# EAGLE design XBEE_BREAKOUT (EAGLE 9.3.0)
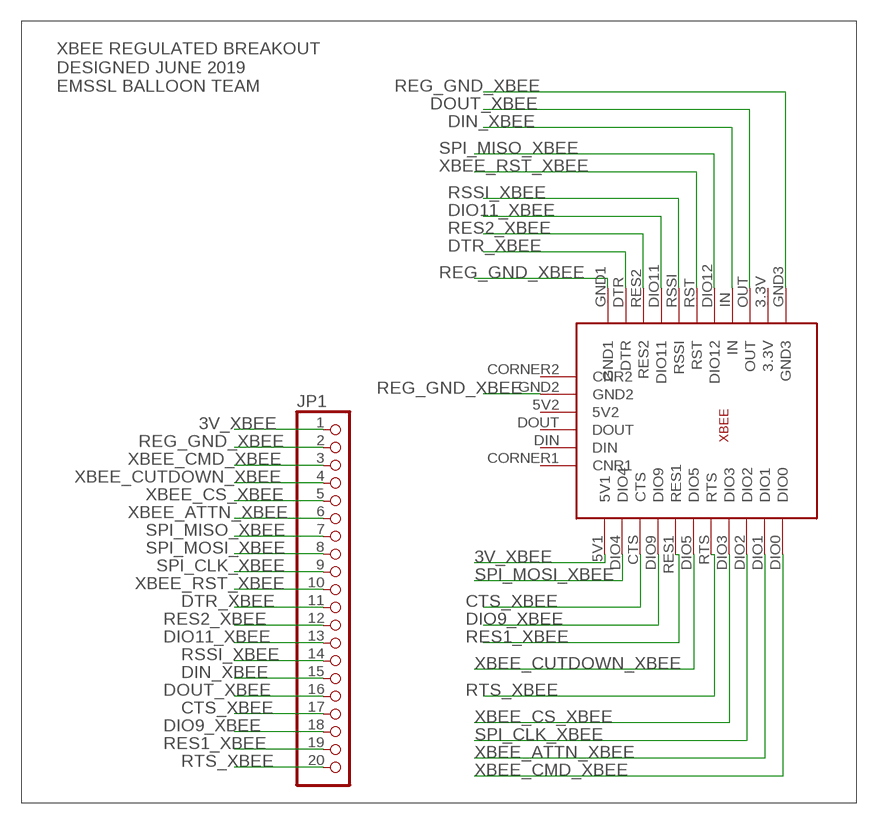
[diagram p0: schematic, sheet 1]

## Parts
JP1  PINHD-1X20/90  [1X20/90]
U$7  XBEE_XPLORER_REG  [XBEE_EXPLORER_REG'D]

## Nets
3V_XBEE: JP1.1 U$7.5V1
CTS_XBEE: JP1.17 U$7.CTS
DIN_XBEE: JP1.15 U$7.IN
DIO9_XBEE: JP1.18 U$7.DIO9
DIO11_XBEE: JP1.13 U$7.DIO11
DOUT_XBEE: JP1.16 U$7.OUT
DTR_XBEE: JP1.11 U$7.DTR
REG_GND_XBEE: JP1.2 U$7.GND1 U$7.GND2 U$7.GND3
RES1_XBEE: JP1.19 U$7.RES1
RES2_XBEE: JP1.12 U$7.RES2
RSSI_XBEE: JP1.14 U$7.RSSI
RTS_XBEE: JP1.20 U$7.RTS
SPI_CLK_XBEE: JP1.9 U$7.DIO2
SPI_MISO_XBEE: JP1.7 U$7.DIO12
SPI_MOSI_XBEE: JP1.8 U$7.DIO4
XBEE_ATTN_XBEE: JP1.6 U$7.DIO1
XBEE_CMD_XBEE: JP1.3 U$7.DIO0
XBEE_CS_XBEE: JP1.5 U$7.DIO3
XBEE_CUTDOWN_XBEE: JP1.4 U$7.DIO5
XBEE_RST_XBEE: JP1.10 U$7.RST
Unconnected: U$7.3.3V U$7.5V2 U$7.CORNER1(CNR1) U$7.CORNER2(CNR2) U$7.DIN U$7.DOUT

## Notes on the sheet
- XBEE REGULATED BREAKOUT 
  DESIGNED JUNE 2019 
  EMSSL BALLOON TEAM

## Library data of the parts
JP1 = pinhead:PINHD-1X20: PIN HEADER
U$7 = Adafruit_Arduino:XBEE_XPLORER_REG

## Board
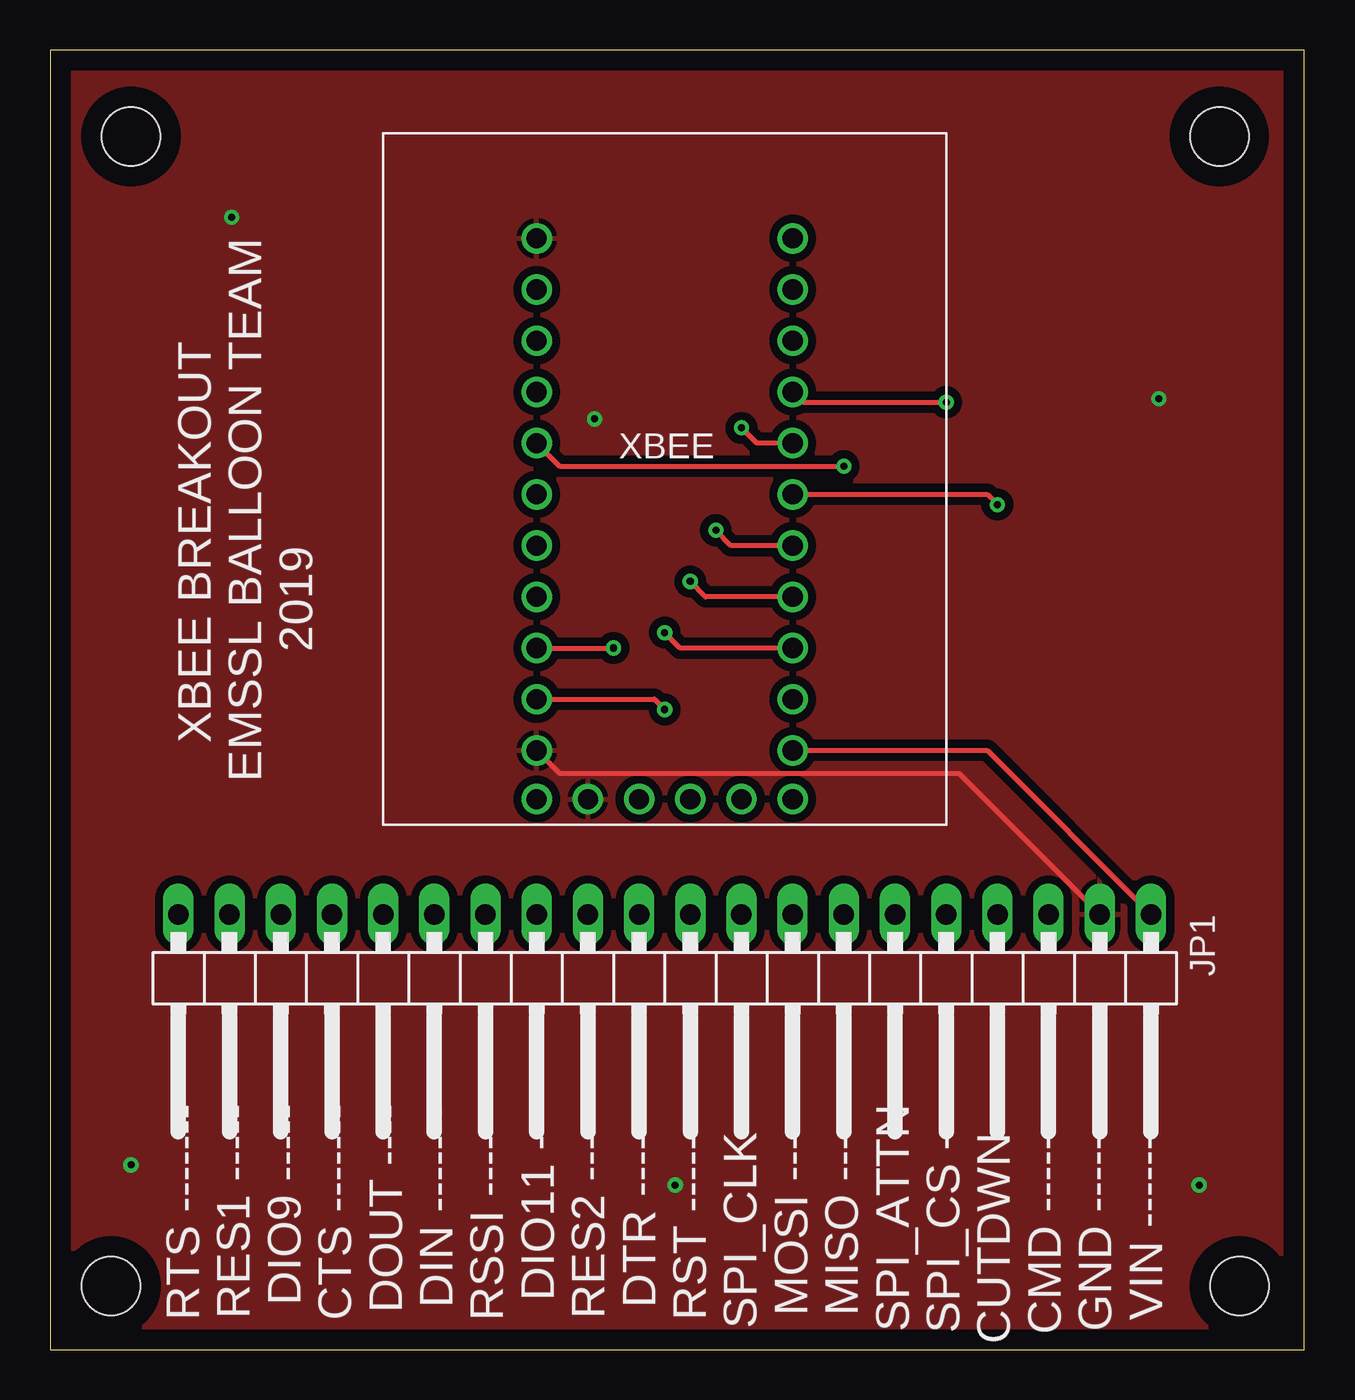
[diagram p1: board, top side]
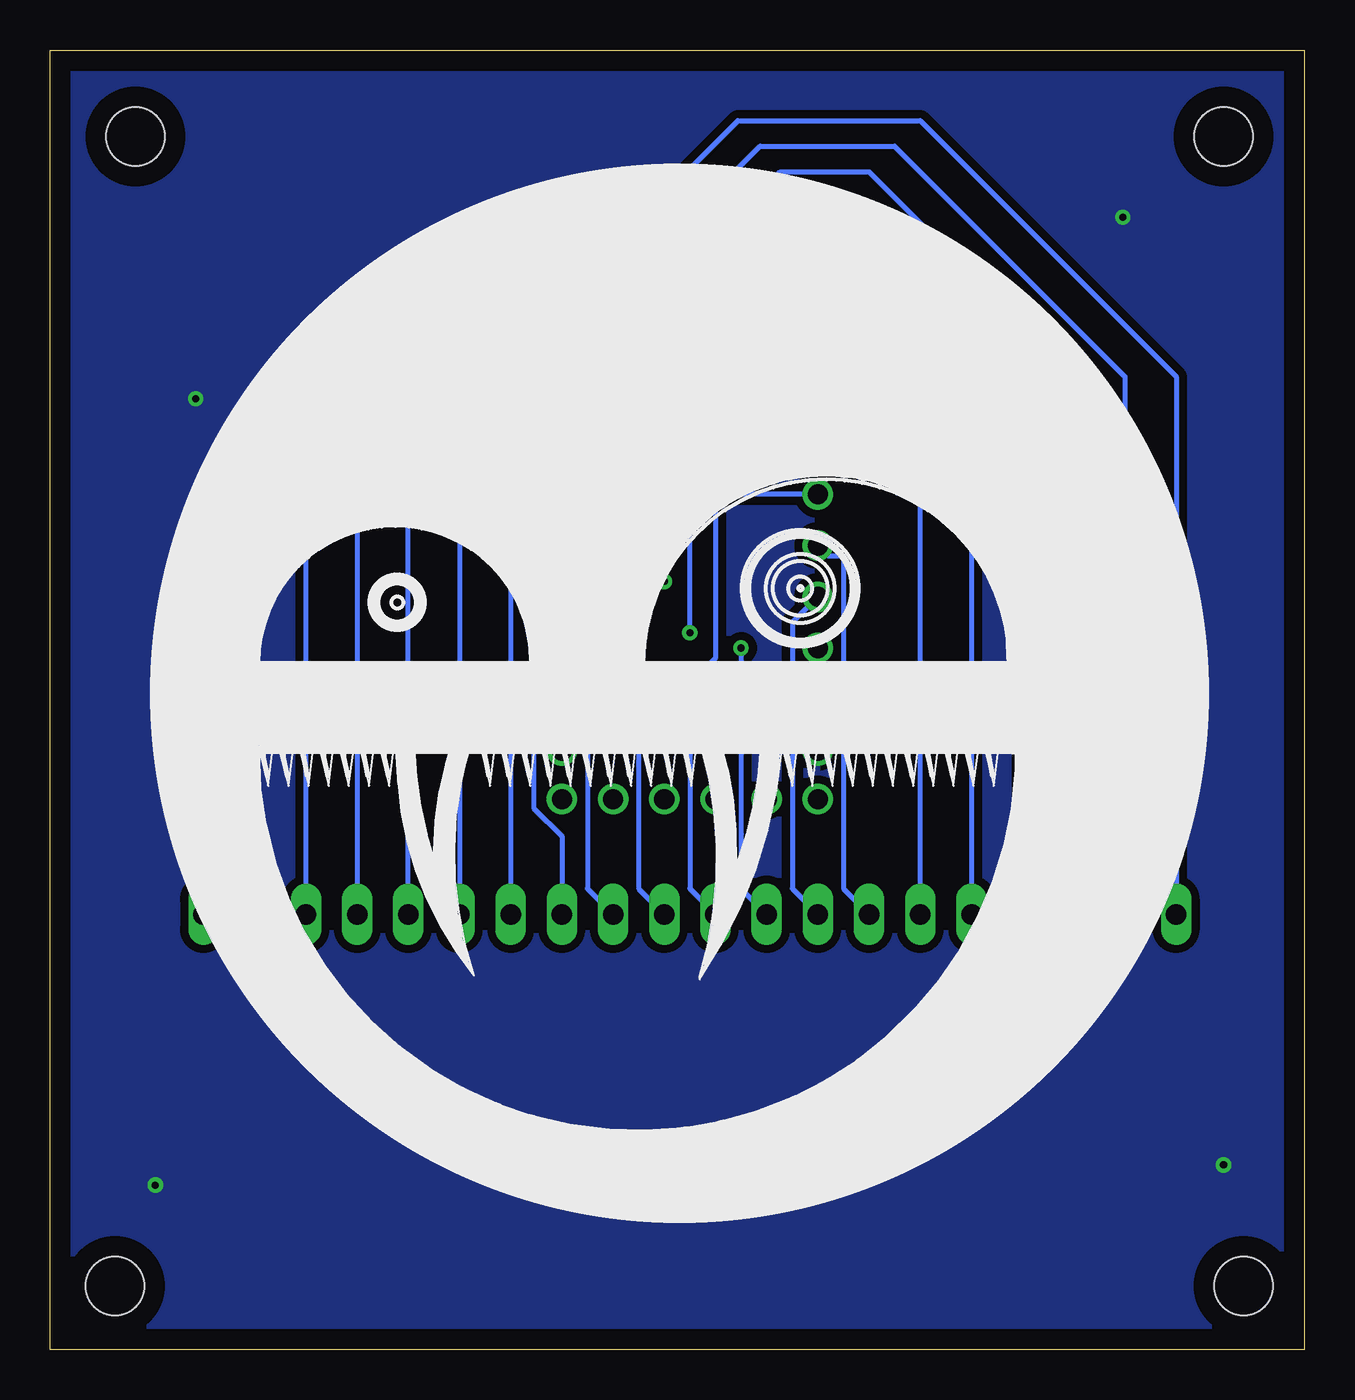
[diagram p2: board, bottom side, seen from below]

Size 62.21 x 64.44 mm. Coordinates in mm from the lower left corner, seen from the top.
Outline: 0,0 62.21,0 62.21,64.44 0,64.44 0,0
Copper layers (1*16): Top 0.035mm / dielectric 1.5mm / Bottom 0.035mm
Design rules "default": minimum track width 6mil, minimum drill 0.35mm, track to track 6mil, track to pad 6mil, pad to pad 6mil, via to via 6mil, smd to smd 6mil, copper to edge 40mil, drill to drill 6mil, minimum pad ring 10mil, minimum via ring 8mil, stop-mask expansion 4mil, vias tented up to drill 0mil, thermal gap 10mil
Holes 2.9 mm at 4,60.16 58,60.16 3,3.16 59,3.16

### Footprints (pad centres in the part's own frame; a part is rotated, then mirrored left to right if it is on the bottom)
1X20/90 = drill 1.016 long: 1 -24.13,-3.81; 2 -21.59,-3.81; 3 -19.05,-3.81; 4 -16.51,-3.81; 5 -13.97,-3.81; 6 -11.43,-3.81; 7 -8.89,-3.81; 8 -6.35,-3.81; 9 -3.81,-3.81; 10 -1.27,-3.81; 11 1.27,-3.81; 12 3.81,-3.81; 13 6.35,-3.81; 14 8.89,-3.81; 15 11.43,-3.81; 16 13.97,-3.81; 17 16.51,-3.81; 18 19.05,-3.81; 19 21.59,-3.81; 20 24.13,-3.81
XBEE_EXPLORER_REG'D = drill 1: 3.3V -6.35,9.398; 5V1 6.35,-13.462; 5V2 -1.27,-15.875; CORNER1 6.35,-15.875; CORNER2 -6.35,-15.875; CTS 6.35,-8.382; DIN 3.81,-15.875; DIO0 6.35,11.938; DIO1 6.35,9.398; DIO2 6.35,6.858; DIO3 6.35,4.318; DIO4 6.35,-10.922; DIO5 6.35,-0.762; DIO9 6.35,-5.842; DIO11 -6.35,-5.842; DIO12 -6.35,1.778; DOUT 1.27,-15.875; DTR -6.35,-10.922; GND1 -6.35,-13.462; GND2 -3.81,-15.875; GND3 -6.35,11.938; IN -6.35,4.318; OUT -6.35,6.858; RES1 6.35,-3.302; RES2 -6.35,-8.382; RSSI -6.35,-3.302; RST -6.35,-0.762; RTS 6.35,1.778

### Placement (x,y rotation side)
JP1  30.48,17.78 180 top
U$7  30.48,43.18 0 top

### Tracks (layer width: path | path; a pad name or v marks a point on that pad's centre or on a via)
3V_XBEE
  Top 0.254: U$7.5V1 46.48,29.72 JP1.1
CTS_XBEE  (via drill 0.35)  (1 unrouted)
  Top 0.254: U$7.CTS 31.24,34.8 v30.48,35.56
  Bottom 0.254: v30.48,35.56 30.48,51.58 24.91,57.15 22.86,57.15 13.97,48.26 JP1.17
DIN_XBEE
  Bottom 0.254: JP1.15 19.05,42.42 U$7.IN
DIO9_XBEE  (via drill 0.35)
  Top 0.254: U$7.DIO9 32.51,37.34 v31.75,38.1
  Bottom 0.254: v31.75,38.1 31.75,52.67 26,58.42 21.59,58.42 11.43,48.26 JP1.18
DIO11_XBEE
  Bottom 0.254: U$7.DIO11 25.4,36.07 25.4,22.86 JP1.13
DOUT_XBEE
  Bottom 0.254: U$7.OUT 16.51,42.42 JP1.16
DTR_XBEE  (via drill 0.35)
  Top 0.254: U$7.DTR 29.97,32.26 v30.48,31.75
  Bottom 0.254: v30.48,31.75 30.48,22.86 JP1.11
REG_GND_XBEE  (via drill 0.35)
  Top 0.254: U$7.GND1 25.27,28.57 45.09,28.57 JP1.2
  other vias: 27,46.16 57,8.16 55,47.16 9,56.16 4,9.16 31,8.16
  pour Top (isolate 0.406): 0,0.16 0,64.46 62.2,64.46 62.2,-0.04 0.2,-0.04
  pour Bottom (isolate 0.406): 0,0.16 0,64.46 62.2,64.46 62.2,-0.04 0.2,-0.04
RES1_XBEE  (via drill 0.35)
  Top 0.254: U$7.RES1 33.78,39.88 v33.02,40.64
  Bottom 0.254: v33.02,40.64 33.02,53.67 27,59.69 20.32,59.69 8.89,48.26 JP1.19
RES2_XBEE  (via drill 0.35)
  Top 0.254: U$7.RES2 v27.94,34.8
  Bottom 0.254: JP1.12 27.94,22.86 v27.94,34.8
RSSI_XBEE
  Bottom 0.254: U$7.RSSI 23.62,39.37 22.86,39.37 22.86,22.86 JP1.14
RTS_XBEE  (via drill 0.35)
  Top 0.254: U$7.RTS 35.05,44.96 v34.29,45.72
  Bottom 0.254: v34.29,45.72 34.29,54.77 28.1,60.96 19.05,60.96 6.35,48.26 JP1.20
SPI_CLK_XBEE
  Bottom 0.254: U$7.DIO2 35.56,48.77 35.56,22.86 JP1.9
SPI_MISO_XBEE  (via drill 0.35)
  Top 0.254: U$7.DIO12 25.27,43.82 v39.37,43.82
  Bottom 0.254: v39.37,43.82 JP1.7
SPI_MOSI_XBEE
  Bottom 0.254: U$7.DIO4 37.34,31.75 38.23,31.75 38.23,26.86 36.83,25.46 JP1.8
XBEE_ATTN_XBEE
  Bottom 0.254: U$7.DIO1 37.4,52.58 41.91,48.07 JP1.6
XBEE_CMD_XBEE
  Bottom 0.254: U$7.DIO0 38.02,55.12 49.53,43.61 JP1.3
XBEE_CS_XBEE  (via drill 0.35)
  Top 0.254: U$7.DIO3 37.34,46.99 v44.45,46.99
  Bottom 0.254: JP1.5 v44.45,46.99
XBEE_CUTDOWN_XBEE  (via drill 0.35)
  Top 0.254: U$7.DIO5 46.48,42.42 v46.99,41.91
  Bottom 0.254: v46.99,41.91 JP1.4
XBEE_RST_XBEE
  Bottom 0.254: U$7.RST 28.7,42.42 29.21,41.91 29.21,34.29 30.48,33.02 31.75,33.02 33.02,31.75 33.02,22.86 JP1.10

### Text on the board
tPlace: XBEE BREAKOUT / EMSSL BALLOON TEAM / 2019 | RTS ------- / RES1 ----- / DIO9 ----- / CTS ------- / DOUT ---- / DIN ------- / RSSI ------ / DIO11 --- / RES2 ----- / DTR ------ / RST ------- / SPI_CLK - / MOSI ----- / MISO ----- / SPI_ATTN / SPI_CS --- / CUTDWN- / CMD ------- / GND ------- / VIN --------